# Altium schematic sheet FTDI_FT232R_USB_To_UART.SchDoc
size A; SheetNumber: 1; SheetTotal: 1
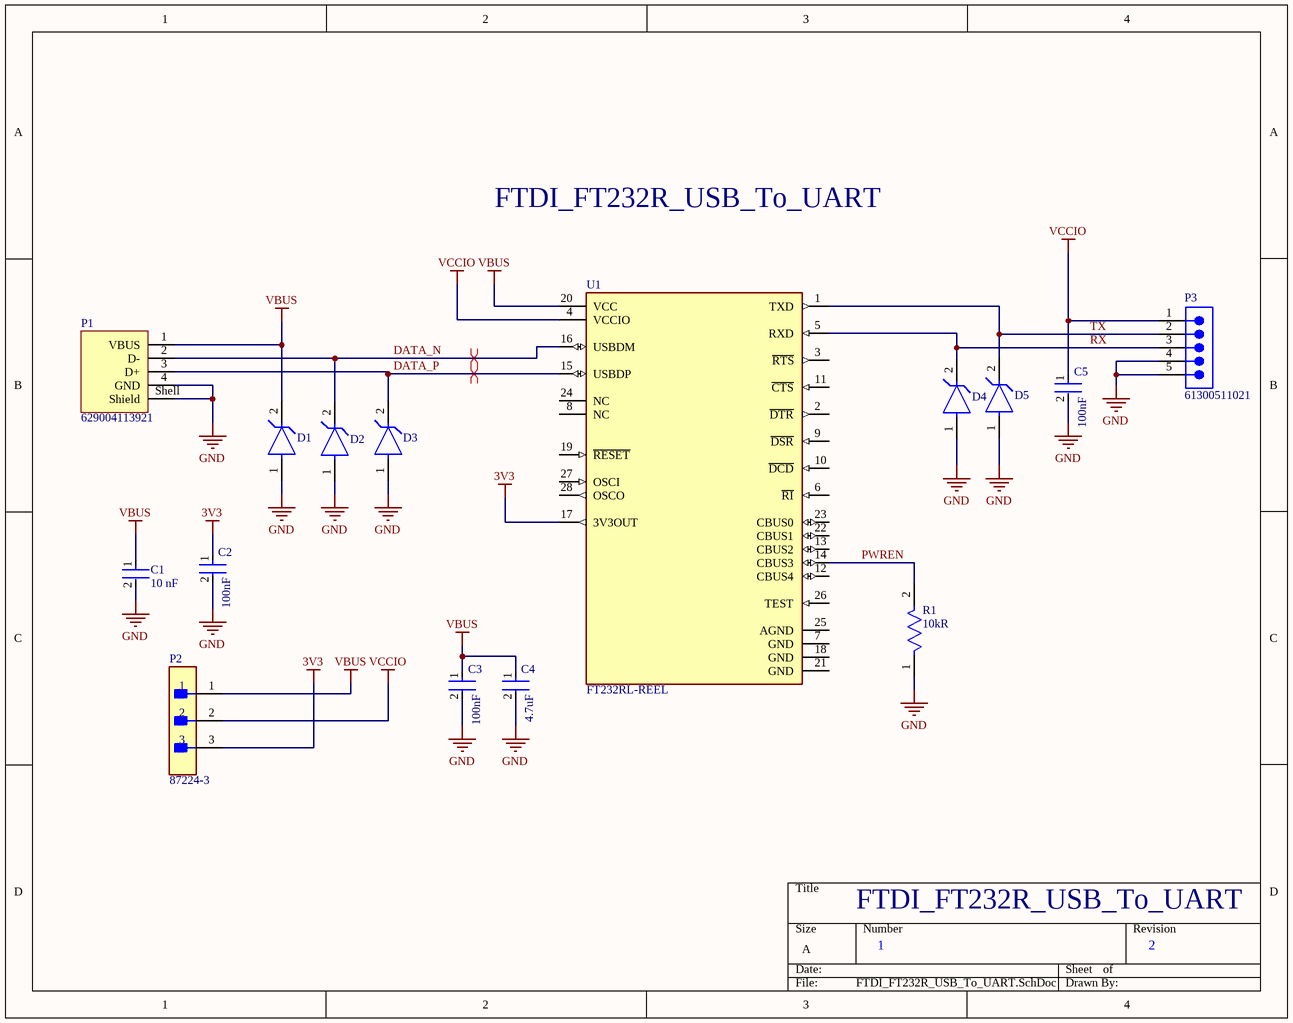
[diagram p0: FTDI_FT232R_USB_To_UART.SchDoc]

## Parts
C1  Capacitance: 10 nF  [FP-CC0402-MFG]  (hidden comment: CC0402KPX7R7BB103)
C2  Capacitance: 100nF  [FP-C1005-050-0_05-MFG]  (hidden comment: C1005X7R1C104K050BC)
C3  Capacitance: 100nF  [FP-C1005-050-0_05-MFG]  (hidden comment: C1005X7R1C104K050BC)
C4  Capacitance: 4.7uF  [FP-GRM155-0_15-MFG]  (hidden comment: GRM155R61A475MEAAD)
C5  Capacitance: 100nF  [FP-C1005-050-0_05-MFG]  (hidden comment: C1005X7R1C104K050BC)
D1  UCLAMP3601P.TNT  [FP-SLP1006P2-MFG]  (value not drawn)
D2  UCLAMP3601P.TNT  [FP-SLP1006P2-MFG]  (value not drawn)
D3  UCLAMP3601P.TNT  [FP-SLP1006P2-MFG]  (value not drawn)
D4  UCLAMP3601P.TNT  [FP-SLP1006P2-MFG]  (value not drawn)
D5  UCLAMP3601P.TNT  [FP-SLP1006P2-MFG]  (value not drawn)
P1  629004113921  [629004113921]
P2  87224-3  [FP-87224-3-MFG]
P3  61300511021  [61300511021]
R1  Resistance: 10kR  [FP-CRG0402-IPC_B]  (hidden comment: CRG0402F10K)
U1  FT232RL-REEL  [FP-SSOP-28-MFG]

## Nets
3V3: C2.1 P2.3 U1.17(3V3OUT)
GND: C1.2 C2.2 C3.2 C4.2 C5.2 D1.1(A) D2.1(A) D3.1(A) D4.1(A) D5.1(A) P1.4(GND) P1.Shell(Shield) P3.4 P3.5 R1.1
VBUS: C1.1 C3.1 C4.1 D1.2(C) P1.1(VBUS) P2.1 U1.20(VCC)
VCCIO: C5.1 P2.2 P3.1 U1.4(VCCIO)
DATA_N: D2.2(C) P1.2(D-) U1.16(USBDM)
DATA_P: D3.2(C) P1.3(D+) U1.15(USBDP)
PWREN: R1.2 U1.14(CBUS3)
RX: D4.2(C) P3.3 U1.5(RXD)
TX: D5.2(C) P3.2 U1.1(TXD)

Not connected (* = marked no-connect by the designer): U1 2(~{DTR}) 3(~{RTS}) 6(~{RI}) 7(GND) 8(NC) 9(~{DSR}) 10(~{DCD}) 11(~{CTS}) 12(CBUS4) 13(CBUS2) 18(GND) 19(~{RESET}) 21(GND) 22(CBUS1) 23(CBUS0) 24(NC) 25(AGND) 26(TEST) 27(OSCI) 28(OSCO)

## Layout directives
differential pair: DATA_N, DATA_P

## Notes on the sheet
- FTDI_FT232R_USB_To_UART
- 1
- 2

## Library data of the parts
C1 = CMP-03422-000420-1: CC0402 10 nF X7R 10.00% 16 V; Manufacturer: YAGEO; Value: 10 nF; Tolerance: 0.1; Voltage Rating: 16 V; Automotive Grade: NA; Temperature Coefficient: 30ppm/°C; Material: Ceramic; Automotive: No; Device Class L1: Passive Components; Temperature Range Low: -55°C; Ipc Land Pattern Name: CAPC10050X50; Temperature Characteristic: X7R; Lead Free: Yes; Footprint Url: http://www.yageo.com/exep/pages/download/literatures/UPY-C_GEN_24.pdf; Octopart: https://octopart.com/cc0402kpx7r7bb103-yageo-12885102; RoHS: TRUE; Height: 0.55mm; Device Class L3: Ceramic Capacitors; Mouser Description: Multilayer Ceramic Capacitors MLCC - SMD/SMT 10nF 16V X7R 10%; Package: CC0402; ComponentLink2Description: Datasheet; Category: Cap; ComponentLink2URL: http://www.yageo.com/documents/recent/UPY-GP_NP0_16V-to-50V_16.pdf; Temperature: -55°C to +125°C; Manufacturer Part Number: CC0402KPX7R7BB103; Temperature Range High: +125°C; Device Class L2: Capacitors
C2 C3 C5 = CMP-08246-004182-1: Multilayer Ceramic Capacitors 100nF ±10% 16V X7R SMD 0402; Voltage: 16V; Depth: 0.5mm; Dielectric Material: Ceramic; Lead Free: Lead Free; Number of Pins: 2; Mount: Surface Mount; Radiation Hardening: No; Case/Package: 0402; Voltage Rating: 16V; Dielectric: X7R; Min Operating Temperature: -55°C; RoHS Compliant: Yes; Tolerance: 10%; Voltage Rating (DC): 16V; Max Operating Temperature: 125°C; Case Code (Metric): 1005; Height: 0.5mm; Thickness: 0.022inch; Package Quantity: 1; Packaging: Tape and Reel; Termination: SMD/SMT; Construction: Flat; Resistor Type: Ceramic; Length: 1mm; Case Code (Imperial): 0402; Width: 0.02inch; Series: C; Weight: 2.3E-05oz
C4 = CMP-06035-003573-1: Chip Multilayer Ceramic Capacitors for General Purpose, 0402, 4.7uF, X5R, 15%, 20%, 10V; Case/Package: 0402; Voltage Rating: 10V; Min Operating Temperature: -55°C; Mount: Surface Mount; Packaging: Tape and Reel; Max Operating Temperature: 85°C; Case Code (Metric): 1005; Case Code (Imperial): 0402; Tolerance: 20%
D1-D5 = CMP-56445-000005-1: TVS DIODE 33VWM 60VC SLP1006P2; Direction: Unidirectional; Min Breakdown Voltage: 36V; Leakage Current: 1uA; Peak Pulse Power: 125W; Power Line Protection: No; Number of Unidirectional Channels: 1; Clamping Voltage: 60V; Peak Pulse Current: 2A; Power Dissipation: 170W; Diode Type: ZENER; Element Configuration: Single; Reverse Standoff Voltage: 33V; Max Breakdown Voltage: 45V; Max Operating Temperature: 125°C; Resistor Type: Zener; Series: Automotive, AEC-Q100, uClamp®; Min Operating Temperature: -40°C; Case Code (Imperial): 0402; Number of Pins: 2; Lead Free: Lead Free; Case/Package: SMD/SMT; RoHS Compliant: Yes; Packaging: Tape and Reel; Clamping Voltage-Max: 60V; Depth: 0.6mm; Case Code (Metric): 1006; Length: 1mm; Radiation Hardening: No; Mount: Surface Mount; Working Voltage: 33V
P1 = CMP-1502-03242-2: NexarPartId: 19991169; USB Standard: USB 2.0; Gender: Male; Connector Type: USB; Contact Resistance: 20mΩ; Current Rating: 1.5A; Number of Contacts: 4; Insulation Resistance: 1GΩ; Operating Supply Voltage: 30V; Termination: SMD/SMT; Lead Free: Lead Free; Max Operating Temperature: 105°C; Mount: Horizontal, Surface Mount; Features: Shielded; Orientation: Horizontal; Length: 18.8mm; REACH SVHC: Unknown; Min Operating Temperature: -40°C; Contact Plating: Gold; Number of Pins: 4; RoHS: Compliant
P2 = CMP-2000-05697-2: CONN HEADER VERT 3POS 2.54MM; Number of Positions: 3; Gasket: No (Without); High Speed Serial Data Connector: No; Current Rating: 3A; Contact Post Length: 0.125inch; PCB Thickness: 1.397mm; PCB Mount Retention: Without; Connector Type: Plug; Approvals: CSA; PCB Mounting Orientation: Vertical; Pitch: 2.54mm; Mating Alignment: No (Without); Housing Color: Black; Contact Gender: Male; Length: 7.21mm; Max Operating Temperature: 105°C; Strain Relief: No (Without); Contact Material: Bronze; Row Spacing: 2.54mm; Series: AMPMODU MOD II; Board Standoff: No (Without); Package Quantity: 520; Radiation Hardening: No; Contact Protection: No (Without); Stabilizers: No (Without); Number of Rows: 1; Contact Mating Length: 8.08mm; Contact Shape: Square; Depth: 2.54mm; Contact Current Rating: 3A; Flammability Rating: UL94 V-0; Packaging: Carton; Number of Contacts: 3; Orientation: Straight; Mount: Through Hole; Keyed: No; Contact Type: Male Pin; Housing Material: Thermoplastic; High Temperature Housing: No; ELV: Compliant; Contact Plating: Gold; Termination: Through Hole; Selectively Loaded: No (Without); Lead Free: Lead Free; Min Operating Temperature: -65°C; Mating Connector Lock: No (Without); Color: Black; RoHS Compliant: Yes
P3 = CMP-1502-01067-3: NexarPartId: 32855525; Contact Resistance: 20mΩ; Current Rating: 3A; Number of Contacts: 5; Pitch: 2.54mm; Operating Supply Voltage: 250V; Connector Type: Male Pin; Gender: Male; Number of Rows: 1; Packaging: Bulk; REACH SVHC: Unknown; Mount: Through Hole; RoHS: Compliant; Termination: Solder; Contact Mating Length: 5.9944mm; Color: Black; Number of Positions: 5; Contact Plating: Gold; Number of Pins: 5; Contact Material: Copper; Lead Pitch: 2.54mm
R1 = CMP-03211-011410-1: RES SMD 10K OHM 1% 1/16W 0402; Voltage Rating (DC): 50V; Temperature Coefficient: 100ppm/°C; Max Power Dissipation: 63mW; Number of Resistors: 1; Max Operating Temperature: 125°C; Mount: Surface Mount; Length: 1mm; Lead Free: Lead Free; Min Operating Temperature: -55°C; Termination: Solder; Military Standard: Not; Width: 0.02inch; Case Code (Imperial): 0402; Construction: Rectangular; Resistance Tolerance: 1%; RoHS Compliant: Yes; Voltage Rating: 50V; Height: 0.35mm; Radiation Hardening: No; Depth: 0.5mm; Resistor Type: Thick Film; Number of Terminations: 2; Packaging: Tape and Reel; Series: CRG, Neohm; ELV: Compliant; Power Rating: 63mW; Case/Package: 0402; Technology: THICK FILM; Tolerance: 1%; REACH SVHC: No SVHC; Package Quantity: 10000
U1 = CMP-0078-00029-4: IC USB FS SERIAL UART 28-SSOP; Data Rate: 12Mbps; Max Supply Voltage: 5.25V; Operating Supply Current: 15mA; Number of Channels: 1; Voltage: 5V; Min Supply Voltage: 3.3V; Radiation Hardening: No; Mount: Surface Mount; Min Operating Temperature: -40°C; Package Quantity: 2000; Number of Transceivers: 1; Width: 5.3mm; Number of Pins: 28; Height: 1.75mm; Weight: 0.080001oz; Lead Free: Lead Free; Length: 10.2mm; REACH SVHC: No SVHC; Max Operating Temperature: 85°C; Packaging: Tape and Reel; Interface: UART; Case/Package: SSOP